# EAGLE design Cap_Switch (EAGLE 9.6.2)
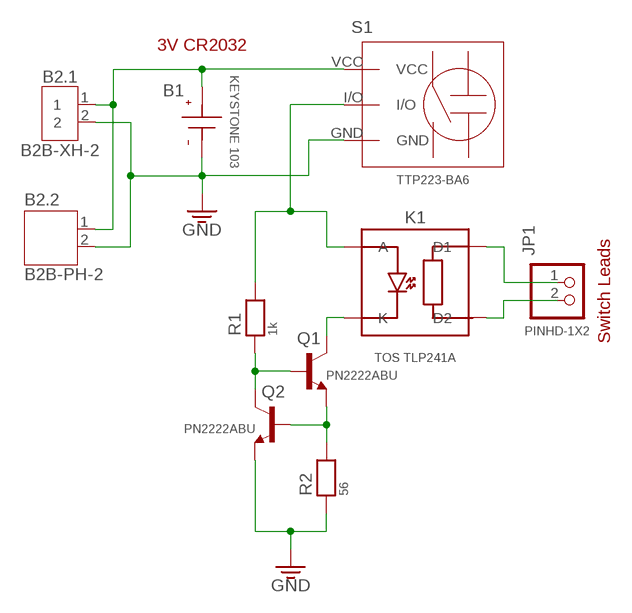
[diagram p0: schematic, sheet 1]

## Parts
B1  KEYSTONE 103  COINCELL-KEYSTONE#1026  [1026_KEY-103]
B2.1  B2B-XH-2  B2B-XH-A  [B2B-XH-A]
B2.2  B2B-PH-2  JST-PH2  [JST-PH2]
JP1  PINHD-1X2  [1X02]
K1  TOS TLP241A  RELAY-SS-TOS-TLP241-A  [TOS-TLP241A]
Q1  PN2222ABU  BJT-NPN-TO-92  [TO92-]
Q2  PN2222ABU  BJT-NPN-TO-92  [TO92-]
R1  1k  RESISTOR1206  [1206]
R2  56  RESISTOR1206  [1206]
S1  TTP223-BA6  SWITCH-CAP-TOUCH-AMZN  [SW-CAP-TOUCH-AMZN]

## Nets
GND [8mil]: B1.-(NEG) B2.1.2 B2.2.2 Q2.1(E) R2.1 S1.GND
K [8mil]: K1.P$2(K) Q1.3(C)
Q1-DRIVE [8mil]: Q1.2(B) Q2.3(C) R1.1
Q2-DRIVE [8mil]: Q1.1(E) Q2.2(B) R2.2
SW-A [Switch]: JP1.1 K1.P$4(D1)
SW-B [Switch]: JP1.2 K1.P$3(D2)
TRIGGER [8mil]: K1.P$1(A) R1.2 S1.I/O
V+ [8mil]: B1.+(POS) B2.1.1 B2.2.1 S1.VCC

## Notes on the sheet
- 3V CR2032
- Switch Leads

## Library data of the parts
B1 = home:COINCELL-KEYSTONE#1026; COPYRIGHT: Copyright (C) 2022 Ultra Librarian. All rights reserved.; DIGI-KEY_PART_NUMBER_1: 1026K-ND; DIGI-KEY_PART_NUMBER_2: 36-1026-ND; DIGI-KEY_PART_NUMBER_3: 2991-1026-ND; MANUFACTURER_PART_NUMBER: 1026; MFR_NAME: Keystone Electronics
B2.1 = Connector_writable:B2B-XH-A: XH Connector Top Entry - 2POS Details see: Datasheet <http://www.jst-mfg.com/product/pdf/eng/eXH.pdf>; CATEGORY: CONNECTOR; DESCRIPTION: 2.5mm pitch/disconnectable crimp style connector; MANUFACTURER: JST (XH CONNECTOR); MPN: B2B-XH-A; OPERATING_TEMPERATURE: -25°C ~ 85°C; PART_STATUS: ACTIVE; ROHS_COMPLIANT: COMPLIANT; SERIES: B_B-XH-A; SUB_CATEGORY: Through hole connector; TYPE: top entry; VALUE: 3A/250V
B2.2 = jst-ph:JST-PH2
JP1 = Connector_writable:PINHD-1X2: PIN HEADER; CATEGORY: CONNECTOR; SUB-CATEGORY: PIN-HEADER
K1 = home:RELAY-SS-TOS-TLP241
Q1 Q2 = home:BJT-NPN
R1 R2 = microbuilder:RESISTOR: Resistors 0402 - 0402 Surface Mount Package 22 Ohm 1% 1/16W [Digikey: 311-22.0LRTR-ND] 33 Ohm 5% 1/16W 1.0K 5% 1/16W 1.5K 5% 1/16W 2.0K 1% 1/16W 10.0K 1% 1/16W [Digikey: 311-10.0KLRTR-ND] 10.0K 5% 1/16W [Digikey: RMCF0402JT10K0TR-ND] 12.1K 1% 1/16W [Digikey: 311-22.0LRTR-ND] 100.0K 5% 1/16W 0603 - 0603 Surface Mount Package 0 Ohm 1/10 Watt 1% Resistor 15 Ohm 1/10 Watt 1% Resistor 33 Ohm 1/10 Watt 1% Resistor 49.9 Ohm 1/10 Watt 1% Resistor 100 Ohm 1/10 Watt 1% Resistor 150 Ohm 1/10 Watt 1% Resistor 240 Ohm 1/10 Watt 1% Resistor 390 Ohm 1/10 Watt 1% Resistor 560 Ohm 1/10 Watt 1% Resistor 680 Ohm 1/10 Watt 1% Resistor 750 Ohm 1/10 Watt 1% Resistor 1.0K Ohm 1/10 Watt 1% Resistor 1.5K Ohm 1/10 Watt 1% Resistor 2.0K Ohm 1/10 Watt 1% Resistor 2.2K Ohm 1/10 Watt 1% Resistor 3.3K Ohm 1/10 Watt 1% Resistor 4.7K Ohm 1/10 Watt 1% Resistor 10.0K Ohm 1/10 Watt 1% Resistor 12.0K Ohm 1/10 Watt 1% Resistor 12.1K Ohm 1/10 Watt 1% Resistor 20.0K Ohm 1/10 Watt 1% Resistor 33.0K Ohm 1/10 Watt 1% Resistor 100.0K Ohm 1/10 Watt 1% Resistor 0805 - 0805 Surface Mount Package 0 Ohm 1/8 Watt 1% Resistor 33 Ohm 1/8 Watt 1% Resistor 100 Ohm 1/8 Watt 1% Resistor 150 Ohm 1/8 Watt 1% Resistor 200 Ohm 1/8 Watt 1% Resistor 240 Ohm 1/8 Watt 1% Resistor 330 Ohm 1/8 Watt 1% Resistor 390 Ohm 1/8 Watt 1% Resistor 470 Ohm 1/8 Watt 1% Resistor 1.0K Ohm 1/8 Watt 1% Resistor 1.5K Ohm 1/8 Watt 1% Resistor 2.0K Ohm 1/8 Watt 1% Resistor 4.7K Ohm 1/8 Watt 1% Resistor 5.1K Ohm 1/8 Watt 1% Resistor 5.6K Ohm 1/8 Watt 1% Resistor 10.0K Ohm 1/8 Watt 1% Resistor 22.0K Ohm 1/8 Watt 1% Resistor 33.0K Ohm 1/8 Watt 1% Resistor 100K Ohm 1/8 Watt 1% Resistor 1206 - 1206 Surface Mount Package 2012 - 2010 Surface Mount Package 0.11 Ohm 1/2 Watt 1% Resistor - Digikey: RHM.11UCT-ND
S1 = home:SWITCH-CAP-TOUCH

## Net classes
1 8mil: width 0.203 mm
2 Switch: width 0.508 mm

## Board
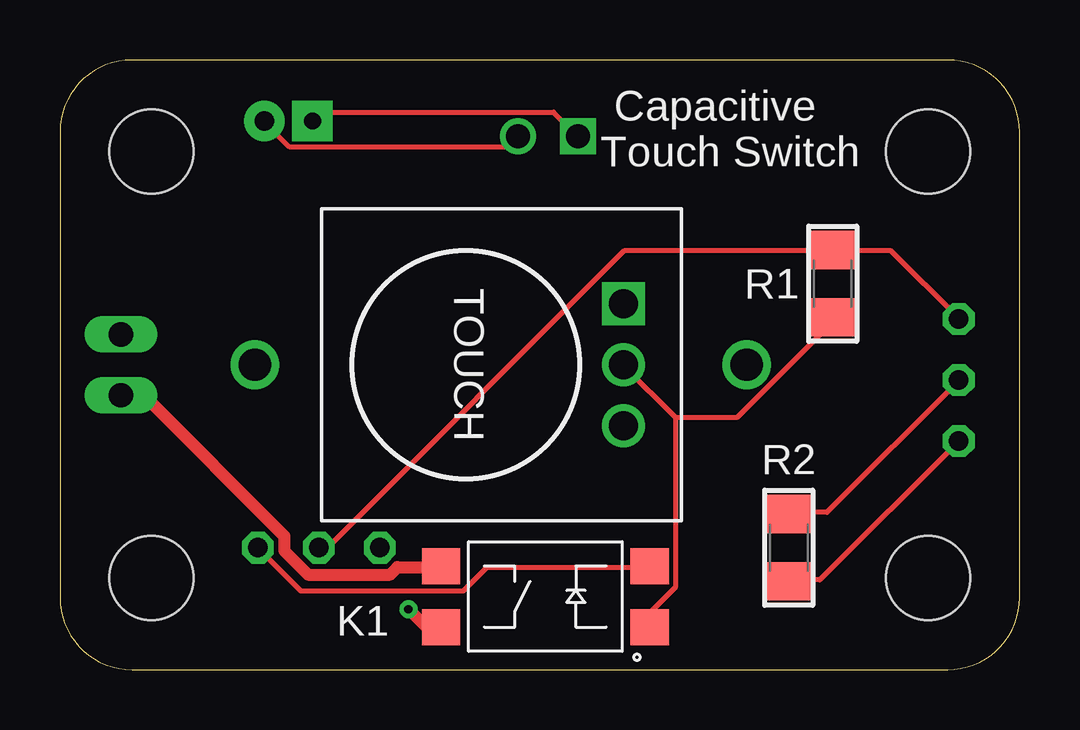
[diagram p1: board, top side]
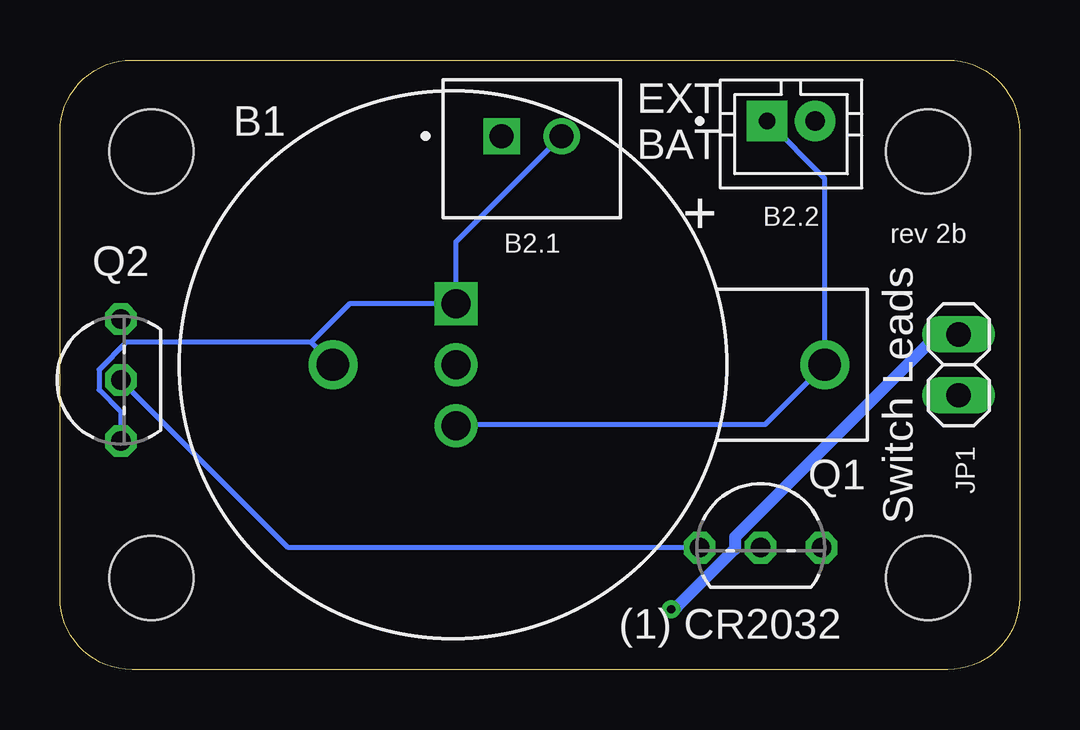
[diagram p2: board, bottom side, seen from below]

Size 40.01 x 25.4 mm. Coordinates in mm from the lower left corner, seen from the top.
Outline: 37.01,25.4 3,25.4 arc90 0,22.4 0,3 arc90 3,0 37.01,0 arc90 40.01,3 40.01,22.4 arc90 37.01,25.4
Copper layers (1*16): Top 0.035mm / dielectric 1.5mm / Bottom 0.035mm
Design rules "default": minimum track width 6mil, minimum drill 0.35mm, track to track 6mil, track to pad 6mil, pad to pad 6mil, via to via 6mil, smd to smd 6mil, copper to edge 40mil, drill to drill 6mil, minimum pad ring 10mil, minimum via ring 8mil, stop-mask expansion 4mil, vias tented up to drill 0mil, thermal gap 10mil
Holes 3.5 mm at 3.81,21.59 36.2,21.59 36.2,3.81 3.81,3.81

### Footprints (pad centres in the part's own frame; a part is rotated, then mirrored left to right if it is on the bottom)
1026_KEY-103 = drill 1.35 pad 2.032: + 0,-15.5; - 0,5
B2B-XH-A = drill 1 square: 1 0,0 | drill 1: 2 2.5,0
JST-PH2 = drill 0.7 pad 1.676 square: 1 1,0 | drill 0.813 pad 1.676: 2 -1,0
1X02 = drill 1.016 long: 1 -1.27,0; 2 1.27,0
TOS-TLP241A = smd 1.6 x 1.5: P$1 -4.35,1.27; P$2 -4.35,-1.27; P$3 4.35,-1.27; P$4 4.35,1.27
TO92- = drill 0.813 octagon: 1 -2.54,0; 2 0,0; 3 2.54,0
1206 = smd 1.6 x 1.8: 1 -1.4,0; 2 1.4,0
SW-CAP-TOUCH-AMZN = drill 1.2 square: GND -2.54,5.08 | drill 1.2: I/O 0,5.08; VCC 2.54,5.08

### Placement (x,y rotation side)
B1  23.62,12.7 90 bottom
B2.1  21.59,22.23 0 bottom
B2.2  9.53,22.86 180 bottom
JP1  2.54,12.7 270 bottom
K1  20.23,3.04 180 top
Q1  10.79,5.08 0 bottom
Q2  37.47,12.06 90 bottom
R1  32.21,16.08 270 top
R2  30.38,5.08 90 top
S1  18.41,12.7 270 top

### Tracks (layer width: path | path; a pad name or v marks a point on that pad's centre or on a via)
GND
  Top 0.203: Q2.1 31.67,3.73 30.45,3.73 R2.1 | B2.1.2 19.07,22.23 18.62,21.77 9.58,21.77 8.59,22.76 8.59,22.8 B2.2.2
  Bottom 0.203: Q2.1 37.47,10.74 38.38,11.66 38.38,12.5 37.24,13.64 29.54,13.64 | 29.54,13.64 27.94,15.24 S1.GND 23.49,17.82 B2.1.2 | 29.54,13.64 28.63,12.72 B1.-
K
  Top 0.203: K1.P$2 24.51,4.27 17.8,4.27 16.81,3.28 10.03,3.28 8.28,5.03 Q1.3
Q1-DRIVE
  Top 0.203: Q2.3 37.47,14.63 34.65,17.45 32.28,17.45 R1.1 32.13,17.45 23.52,17.45 11.18,5.11 10.79,5.11 Q1.2
Q2-DRIVE
  Top 0.203: R2.2 30.45,6.55 31.98,6.55 37.47,12.04 Q2.2
  Bottom 0.203: Q1.1 13.36,5.11 30.5,5.11 Q2.2
SW-A  (via drill 0.35)
  Top 0.508: v14.53,2.52 15.21,1.83 15.82,1.83 K1.P$4
  Bottom 0.508: JP1.1 2.57,13.95 3.44,13.95 11.86,5.52 11.86,5.03 14.3,2.59 v14.53,2.52
SW-B
  Top 0.508: JP1.2 3.48,11.43 9.35,5.56 9.35,4.95 10.34,3.96 13.77,3.96 14.07,4.27 15.82,4.27 K1.P$3
TRIGGER
  Top 0.203: 25.65,10.52 25.65,3.43 24.59,2.36 24.59,1.83 K1.P$1 | 25.65,10.52 23.52,12.65 S1.I/O | 25.65,10.52 28.24,10.52 32.21,14.48 32.21,14.63 R1.2
V+
  Top 0.203: B2.2.1 10.57,22.86 10.94,23.23 20.58,23.23 B2.1.1
  Bottom 0.203: S1.VCC 23.44,10.21 10.61,10.21 B1.+ 8.12,20.46 B2.2.1

### Text on the board
tPlace: Capacitive | Touch Switch
bPlace: EXT / BAT | + | rev 2b | Switch Leads | (1) CR2032